# EAGLE design EVGP_Estop_Daugherboard_with_LED (EAGLE 9.5.1)
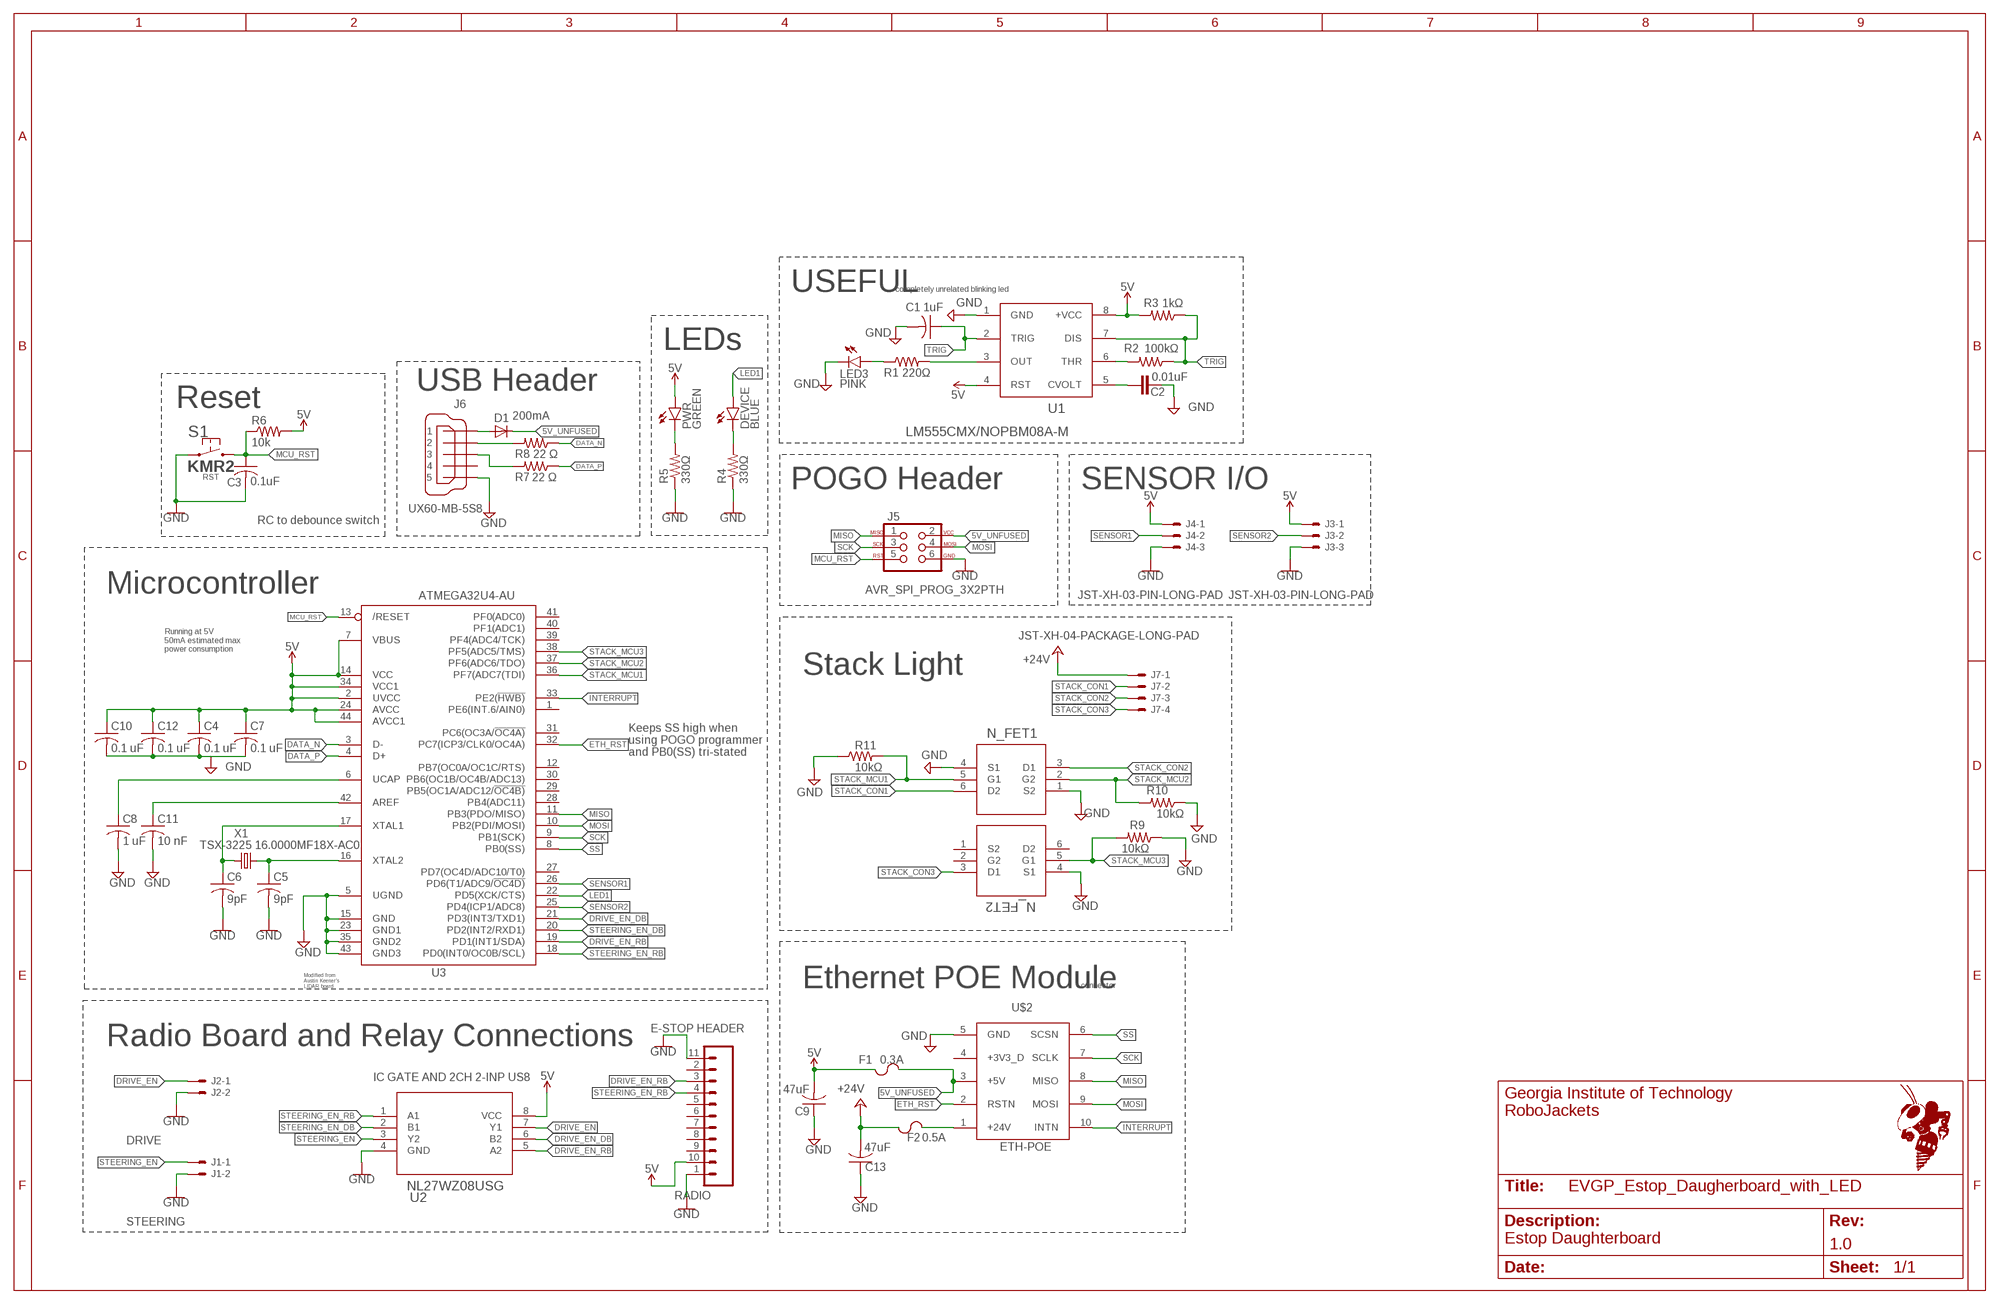
[diagram p0: schematic, sheet 1]
FRAME1 (FRAME_B_L): REVISION: 1.0; SCH_DESC: EVGP Steering Control Board
FRAME2 (FRAME_B_L): REVISION: 1.0; SCH_DESC: EVGP Steering Control Board

## Parts
C1  1uF  C-USC1206  [C1206]
C2  0.01uF  C-EUC0603  [C0603]
C3  0.1uF  C-USC0603  [C0603]
C4  0.1 uF  C-USC0603  [C0603]
C5  9pF  C-USC0603  [C0603]
C6  9pF  C-USC0603  [C0603]
C7  0.1 uF  C-USC0603  [C0603]
C8  1 uF  C-USC0603  [C0603]
C9  47uF  C-USC1206  [C1206]
C10  0.1 uF  C-USC0603  [C0603]
C11  10 nF  C-USC0603  [C0603]
C12  0.1 uF  C-USC0603  [C0603]
C13  47uF  C-USC1206  [C1206]
D1  200mA  DIODE-SOD323-R  [SOD323-R]
DEVICE  BLUE  LEDCHIP-LED0603  [CHIP-LED0603]
F1  0.3A  CHIP_FUSE1206  [F1206]
F2  0.5A  CHIP_FUSE1206  [F1206]
J1  STEERING  JST-XH-02-PIN-LONG-PAD  [JST-XH-02-PACKAGE-LONG-PAD]
J2  DRIVE  JST-XH-02-PIN-LONG-PAD  [JST-XH-02-PACKAGE-LONG-PAD]
J3  JST-XH-03-PIN-LONG-PAD  [JST-XH-03-PACKAGE-LONG-PAD]
J4  JST-XH-03-PIN-LONG-PAD  [JST-XH-03-PACKAGE-LONG-PAD]
J5  AVR_SPI_PROG_3X2PTH  [2X3]
J6  UX60-MB-5S8  [UX60-MB-5S8]
J7  JST-XH-04-PACKAGE-LONG-PAD  JST-XH-04-PIN-LONG-PAD  [JST-XH-04-PACKAGE-LONG-PAD]
LED3  PINK  LEDCHIP-LED0603  [CHIP-LED0603]
PWR  GREEN  LEDCHIP-LED0603  [CHIP-LED0603]
Q1  N_FET2  BSS84DW-7-F  [SOT-363]
Q2  N_FET1  BSS84DW-7-F  [SOT-363]
R1  220Ω  R-US_R0603  [R0603]
R2  100kΩ  R-US_R0603  [R0603]
R3  1kΩ  R-US_R0603  [R0603]
R4  330Ω  R-US_R0603  [R0603]
R5  330Ω  R-US_R0603  [R0603]
R6  10k  R-US_R0603  [R0603]
R7  22 Ω  R-US_R0603  [R0603]
R8  22 Ω  R-US_R0603  [R0603]
R9  10kΩ  R-US_R0603  [R0603]
R10  10kΩ  R-US_R0603  [R0603]
R11  10kΩ  R-US_R0603  [R0603]
RADIO  E-STOP HEADER  ESTOP_RADIO  [RADIO_V1.3]
S1  KMR2  [KMR2]
U1  LM555CMX/NOPBM08A-M  [M08A-M]
U2  NL27WZ08USG  [US8_2P40X2P10]
U3  ATMEGA32U4-AU  [TQFP44]
U$2  ETH-POE  [HDRVR10W64P4000X254_2X5_1016X508X254B]
X1  TSX-3225 16.0000MF18X-AC0  XTAL-3.2X2.5  [XTAL-3.2X2.5]

## Nets
5V [power]: C4.1 C7.1 C9.2 C10.1 C12.1 F1.1 J3.1 J4.1 PWR.A R3.2 R6.2 RADIO.10(5V) U1.4(RST) U1.8(+VCC) U2.8(VCC) U3.2(UVCC) U3.7(VBUS) U3.14(VCC) U3.24(AVCC) U3.34(VCC1) U3.44(AVCC1)
5V_UNFUSED [power]: D1.C F1.2 J5.2 U$2.3(+5V)
24V_UNFUSED: F2.2 U$2.1(+24V)
+24V: C13.2 F2.1 J7.1
AREF: C11.1 U3.42(AREF)
DATA_N [RF]: R8.1 U3.3(D-)
DATA_P [RF]: R7.1 U3.4(D+)
DRIVE_EN: J2.1 U2.7(Y1)
DRIVE_EN_DB: U2.6(B2) U3.21(PD3(INT3/TXD1))
DRIVE_EN_RB: RADIO.3(D1) U2.5(A2) U3.19(PD1(INT1/SDA))
ETH_RST: U3.32(PC7(ICP3/CLK0/OC4A)) U$2.2(RSTN)
GND [power]: C1.2 C2.2 C3.2 C4.2 C5.2 C6.2 C7.2 C8.2 C9.1 C10.2 C11.2 C12.2 C13.1 J1.2 J2.2 J3.3 J4.3 J5.6 J6.5 LED3.C Q1.4(S1) Q2.1(S2) Q2.4(S1) R4.1 R5.1 R9.1 R10.1 R11.1 RADIO.1(GND) RADIO.11(GND) S1.1.1 S1.1.2 U1.1(GND) U2.4(GND) U3.5(UGND) U3.15(GND) U3.23(GND1) U3.35(GND2) U3.43(GND3) U$2.5(GND)
INTERRUPT: U3.33(PE2(!HWB)) U$2.10(INTN)
LED1: DEVICE.A U3.22(PD5(XCK/CTS))
MCU_RST: C3.1 J5.5 R6.1 S1.2.1 S1.2.2 U3.13(/RESET)
MISO: J5.1 U3.11(PB3(PDO/MISO)) U$2.8(MISO)
MOSI: J5.4 U3.10(PB2(PDI/MOSI)) U$2.9(MOSI)
N$1: LED3.A R1.1
N$2: R2.2 U1.6(THR)
N$3: PWR.C R5.2
N$4: C2.1 U1.5(CVOLT)
N$5: J6.2 R8.2
N$6: DEVICE.C R4.2
N$7: D1.A J6.1
N$8: R1.2 U1.3(OUT)
N$11: J6.3 R7.2
SCK: J5.3 U3.9(PB1(SCK)) U$2.7(SCLK)
SENSOR1: J4.2 U3.26(PD6(T1/ADC9/!OC4D))
SENSOR2: J3.2 U3.25(PD4(ICP1/ADC8))
SS: U3.8(PB0(SS)) U$2.6(SCSN)
STACK_CON1: J7.2 Q2.6(D2)
STACK_CON2: J7.3 Q2.3(D1)
STACK_CON3: J7.4 Q1.3(D1)
STACK_MCU1: Q2.5(G1) R11.2 U3.36(PF7(ADC7(TDI))
STACK_MCU2: Q2.2(G2) R10.2 U3.37(PF6(ADC6/TDO))
STACK_MCU3: Q1.5(G1) R9.2 U3.38(PF5(ADC5/TMS))
STEERING_EN: J1.1 U2.3(Y2)
STEERING_EN_DB: U2.2(B1) U3.20(PD2(INT2/RXD1))
STEERING_EN_RB: RADIO.4(D2) U2.1(A1) U3.18(PD0(INT0/OC0B/SCL))
TRIG: C1.1 R2.1 R3.1 U1.2(TRIG) U1.7(DIS)
UCAP: C8.1 U3.6(UCAP)
XTAL1: C6.1 U3.17(XTAL1) X1.1
XTAL2: C5.1 U3.16(XTAL2) X1.3
Unconnected: J6.4 Q1.1(S2) Q1.2(G2) Q1.6(D2) RADIO.2(RST) RADIO.5(D3) RADIO.6(D4) RADIO.7(D5) RADIO.8(D6) RADIO.9(D7) U3.1(PE6(INT.6/AIN0)) U3.12(PB7(OC0A/OC1C/RTS)) U3.27(PD7(OC4D/ADC10/T0)) U3.28(PB4(ADC11)) U3.29(PB5(OC1A/ADC12/!OC4B)) U3.30(PB6(OC1B/OC4B/ADC13)) U3.31(PC6(OC3A/!OC4A)) U3.39(PF4(ADC4/TCK)) U3.40(PF1(ADC1)) U3.41(PF0(ADC0)) U$2.4(+3V3_D)

## Notes on the sheet
- USEFUL | completely unrelated blinking led
- LEDs
- USB Header
- Reset
- POGO Header | SENSOR I/O
- RC to debounce switch
- Microcontroller
- Running at 5V
  50mA estimated max
  power consumption
- Stack Light
- Keeps SS high when
  using POGO programmer
  and PB0(SS) tri-stated
- Modified from 
  Austin Keener's 
  LIDAR board
- Ethernet POE Module | connector
- Radio Board and Relay Connections
- IC GATE AND 2CH 2-INP US8
- Estop Daughterboard

## Library data of the parts
C1 C3 C9 C13 = rcl:C-US: CAPACITOR, American symbol; SPICEPREFIX: C
C2 = rcl:C-EU: CAPACITOR, European symbol; SPICEPREFIX: C
C4-C8 C10-C12 = resistor:C-US: CAPACITOR, American symbol
D1 = RoboJackets-Diodes:DIODE-: DIODE
DEVICE LED3 PWR = led:LED: LED OSRAM: - CHIPLED LG R971, LG N971, LY N971, LG Q971, LY Q971, LO R971, LY R971 LH N974, LH R974 LS Q976, LO Q976, LY Q976 LO Q996 - Hyper CHIPLED LW Q18S LB Q993, LB Q99A, LB R99A - SideLED LS A670, LO A670, LY A670, LG A670, LP A670 LB A673, LV A673, LT A673, LW A673 LH A674 LY A675 LS A676, LA A676, LO A676, LY A676, LW A676 LS A679, LY A679, LG A679 - Hyper Micro SIDELED® LS Y876, LA Y876, LO Y876, LY Y876 LT Y87S - SmartLED LW L88C, LW L88S LB L89C, LB L89S, LG L890 LS L89K, LO L89K, LY L89K LS L896, LA L896, LO L896, LY L896 - TOPLED LS T670, LO T670, LY T670, LG T670, LP T670 LSG T670, LSP T670, LSY T670, LOP T670, LYG T670 LG T671, LOG T671, LSG T671 LB T673, LV T673, LT T673, LW T673 LH T674 LS T676, LA T676, LO T676, LY T676, LB T676, LH T676, LSB T676, LW T676 LB T67C, LV T67C, LT T67C, LS T67K, LO T67K, LY T67K, LW E67C LS E67B, LA E67B, LO E67B, LY E67B, LB E67C, LV E67C, LT E67C LW T67C LS T679, LY T679, LG T679 LS T770, LO T770, LY T770, LG T770, LP T770 LB T773, LV T773, LT T773, LW T773 LH T774 LS E675, LA E675, LY E675, LS T675 LS T776, LA T776, LO T776, LY T776, LB T776 LHGB T686 LT T68C, LB T68C - Hyper Mini TOPLED® LB M676 - Mini TOPLED Santana® LG M470 LS M47K, LO M47K, LY M47K Source: http://www.osram.convergy.de LUXEON: - LUMILED® LXK2-PW12-R00, LXK2-PW12-S00, LXK2-PW14-U00, LXK2-PW14-V00 LXK2-PM12-R00, LXK2-PM12-S00, LXK2-PM14-U00 LXK2-PE12-Q00, LXK2-PE12-R00, LXK2-PE12-S00, LXK2-PE14-T00, LXK2-PE14-U00 LXK2-PB12-K00, LXK2-PB12-L00, LXK2-PB12-M00, LXK2-PB14-N00, LXK2-PB14-P00, LXK2-PB14-Q00 LXK2-PR12-L00, LXK2-PR12-M00, LXK2-PR14-Q00, LXK2-PR14-R00 LXK2-PD12-Q00, LXK2-PD12-R00, LXK2-PD12-S00 LXK2-PH12-R00, LXK2-PH12-S00 LXK2-PL12-P00, LXK2-PL12-Q00, LXK2-PL12-R00 Source: www.luxeon.com KINGBRIGHT: KA-3528ASYC Source: www.kingbright.com
F1 F2 = RoboJackets-Fuses:CHIP_FUSE
J1 J2 = Rembrandt Electronics - JST XH Connectors v1-0:JST-XH-02-PIN: JST XH Connector 2 Pin Wire to board connector. Pitch: 2,54 mm, (0.100") Number of pins: 2 Created by Rembrandt Electronics www.rembrandtelectronics.com
J3 J4 = Rembrandt Electronics - JST XH Connectors v1-0:JST-XH-03-PIN: JST XH Connector 2 Pin Wire to board connector. Pitch: 2,54 mm, (0.100") Number of pins: 3 Created by Rembrandt Electronics www.rembrandtelectronics.com
J5 = SparkFun-Connectors:AVR_SPI_PROG_3X2: AVR ISP 6 Pin This is the reduced ISP connector for AVR programming. Common on Arduino. This footprint will take up less PCB space and can be used with a 10-pin to 6-pin adapter such as SKU: BOB-08508 **Special note about "TEST_POINT" package. The stop mask is on the top side, so if you want your programming test points to be on the bottom of your board, make sure to place this package on the bottom side of the board. This also ensure that the orientation to program from the bottom side will be correct. SparkFun Products: SparkFun ISP Pogo Adapter <https://www.sparkfun.com/products/11591> - NS Tiny AVR Programmer <https://www.sparkfun.com/products/11801> -PTH
J6 = RoboJackets-Connectors:UX60*-MB-5S?: Mini USB Connector Brand: Hirose Electric Co Ltd <http://www.hirose.com/us/> Series: UX <http://www.digikey.com/product-search/en?FV=fff40016,fff802e4,ffec3225> Distributor: Digi-Key <http://www.digikey.com/product-detail/en/UX60A-MB-5ST/H2961CT-ND/597540>; PINS: 5
J7 = Rembrandt Electronics - JST XH Connectors v1-0:JST-XH-04-PIN: JST XH Connector 2 Pin Wire to board connector. Pitch: 2,54 mm, (0.100") Number of pins: 4 Created by Rembrandt Electronics www.rembrandtelectronics.com
Q1 Q2 = Daughterboard-Stuff:BSS84DW-7-F: dual mosfet; MANUFACTURER_PART_NUMBER: BSS84DW7F; VENDOR: Diodes Inc
R1-R11 = rcl:R-US_: RESISTOR, American symbol; SPICEPREFIX: R
RADIO = board_outline:ESTOP_RADIO
S1 = RoboJackets-Switches:KMR2; FUNCTION: RST
U1 = 555:LM555CMX/NOPB; BUILT_BY: EMA_UL_Team; COPYRIGHT: Copyright (C) 2018 Accelerated Designs. All rights reserved; MANUFACTURER_PART_NUMBER: LM555CMX/NOPB; VENDOR: Texas Instruments
U2 = Daughterboard-Stuff:NL27WZ08USG; MANUFACTURER_PART_NUMBER: NL27WZ08USG; VENDOR: ON Semiconductor
U3 = estop-v1.0:ATMEGA32U4: http://www.ladyada.net/library/eagle
U$2 = ethernet_poe:ETH-POE: POE
X1 = RoboJackets-FreqGen:XTAL

## Net classes
0 default: width 0.203 mm, drill 0.508 mm, clearance 0.178 mm
1 power: width 0.305 mm, drill 0.508 mm, clearance 0.178 mm
2 RF: width 0.203 mm, clearance 0.178 mm

## Board
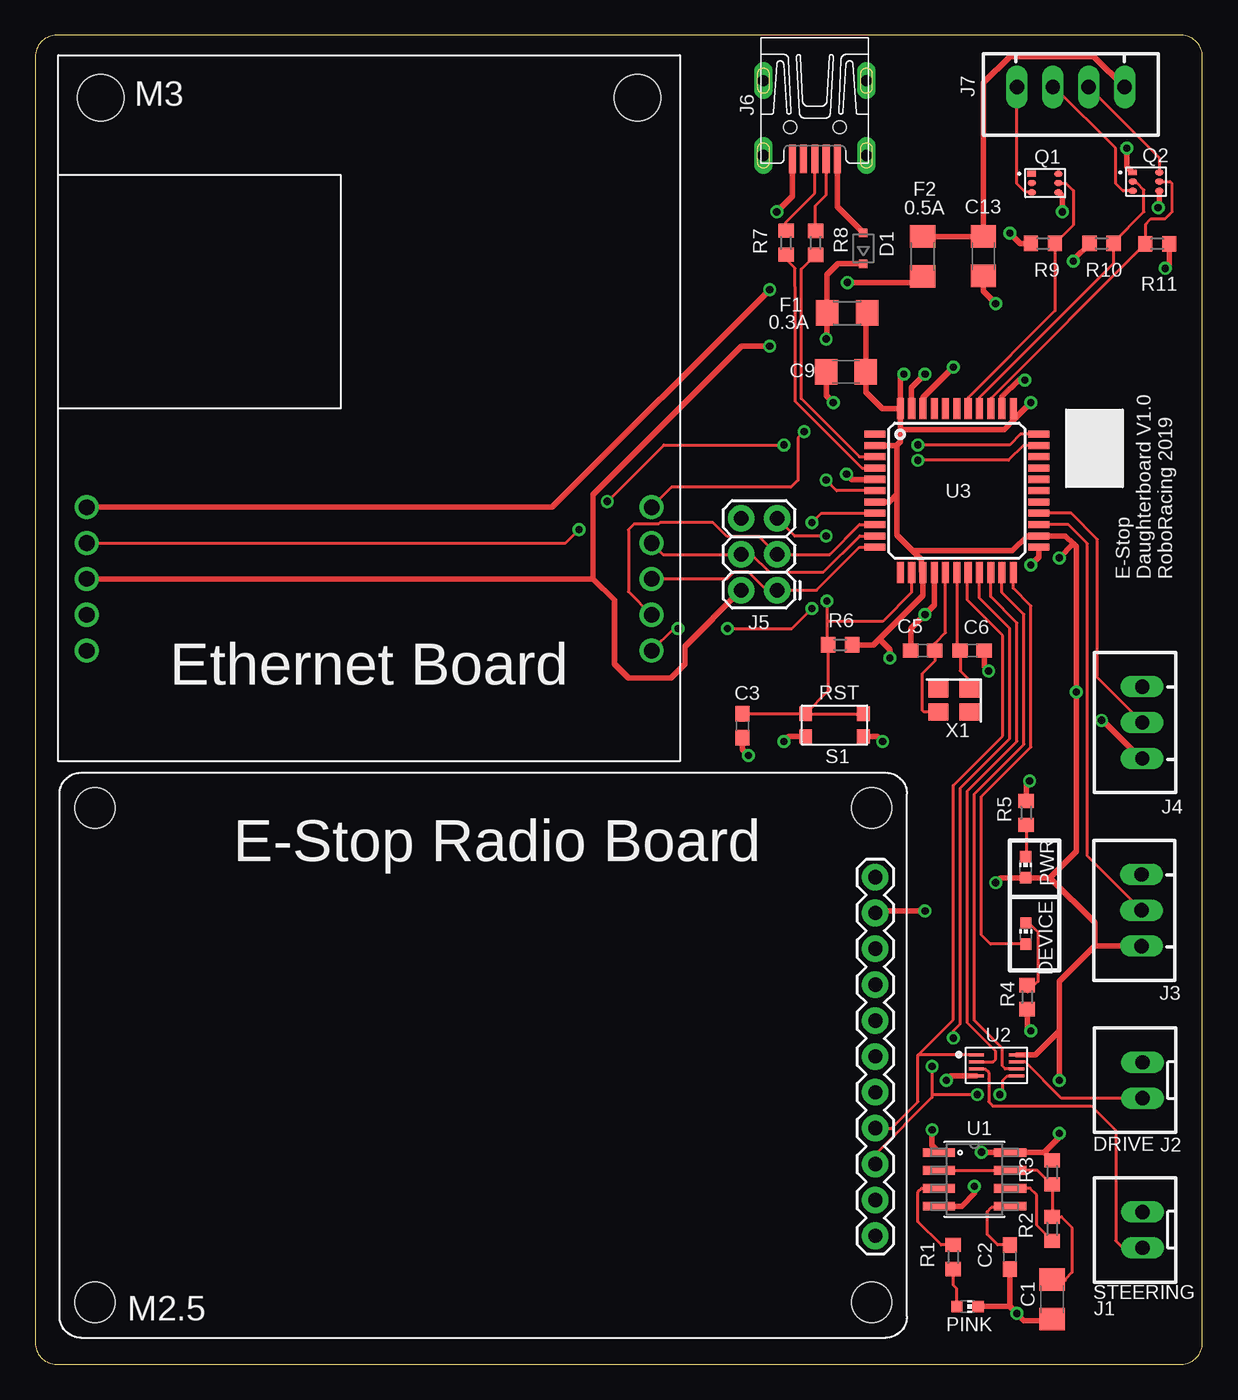
[diagram p1: board, top side]
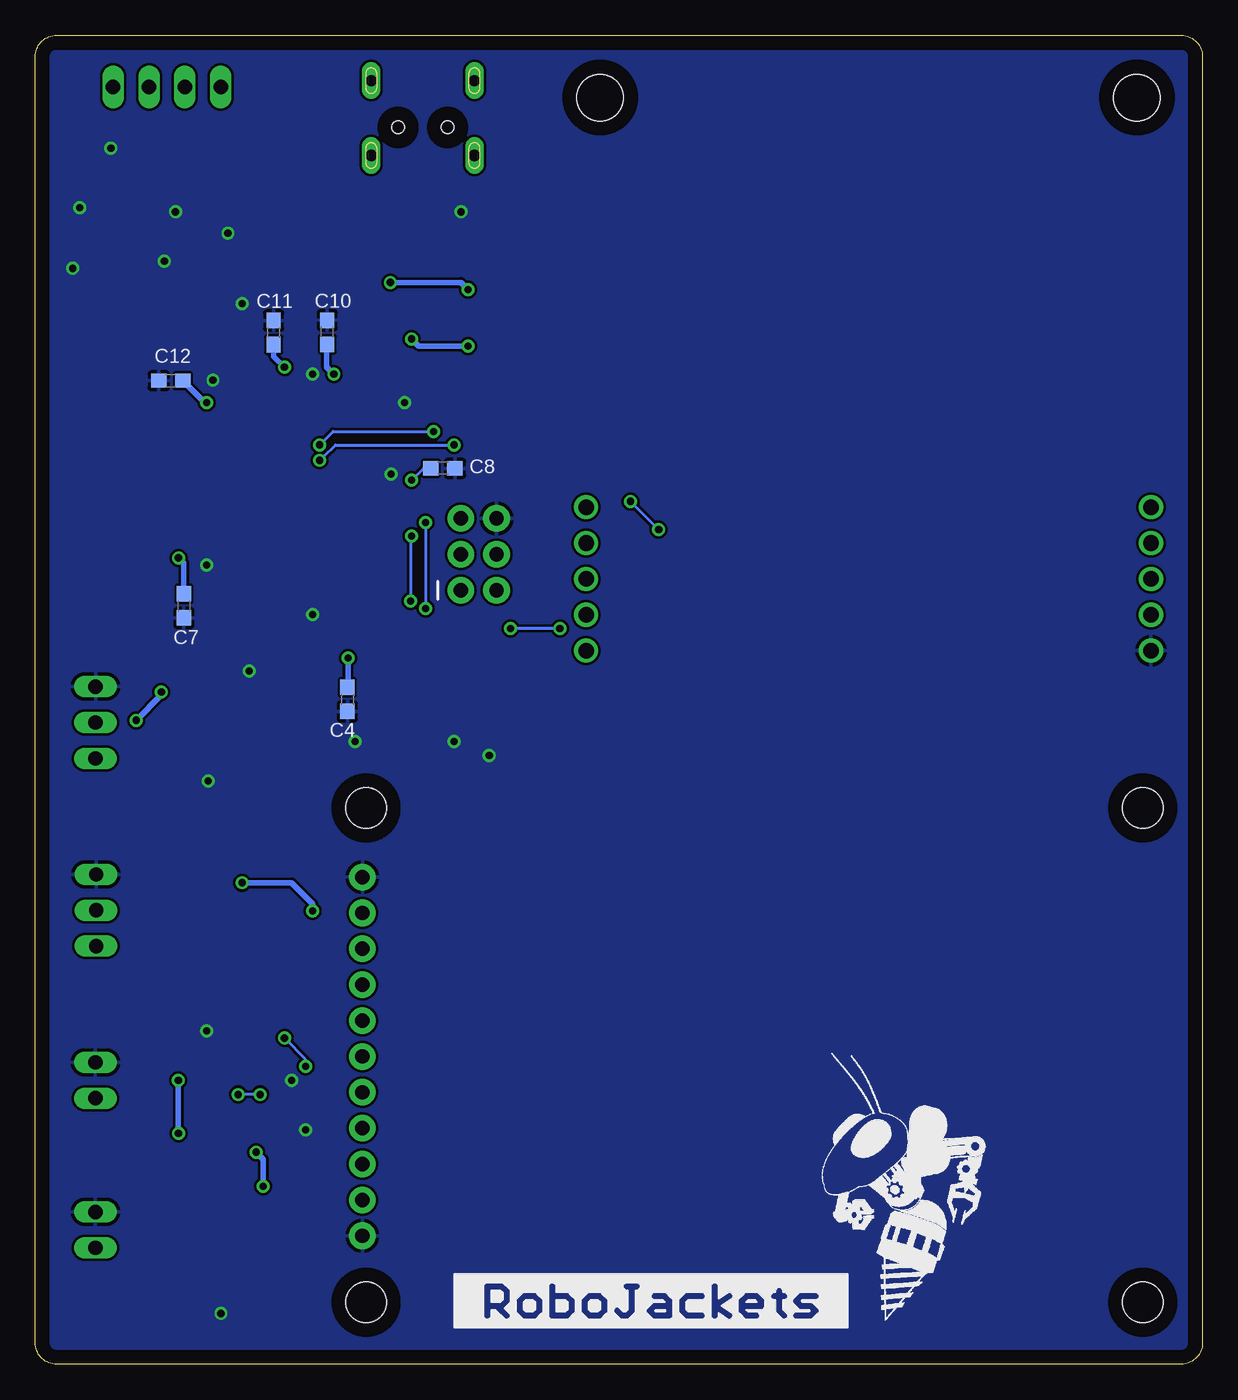
[diagram p2: board, bottom side, seen from below]

Size 82.64 x 94.09 mm. Coordinates in mm from the lower left corner, seen from the top.
Outline: 0,92.59 0,1.5 arc90 1.5,0 81.14,0 arc90 82.64,1.5 82.64,92.59 arc90 81.14,94.09 1.5,94.09 arc90 0,92.59
Copper layers (1*16): Top 0.035mm / dielectric 1.5mm / Bottom 0.035mm
Design rules "default": minimum track width 6mil, minimum drill 0.35mm, track to track 6mil, track to pad 6mil, pad to pad 6mil, via to via 6mil, smd to smd 6mil, copper to edge 40mil, drill to drill 6mil, minimum pad ring 10mil, minimum via ring 8mil, stop-mask expansion 4mil, vias tented up to drill 0mil, thermal gap 10mil

### Footprints (pad centres in the part's own frame; a part is rotated, then mirrored left to right if it is on the bottom)
C1206 = smd 1.6 x 1.8: 1 -1.4,0; 2 1.4,0
C0603 = smd 1.1 x 1: 1 -0.85,0; 2 0.85,0
SOD323-R = smd 0.6 x 0.6: A 1.1,0; C -1.1,0
CHIP-LED0603 = smd 0.8 x 0.8: A 0,-0.75; C 0,0.75
F1206 = smd 1.6 x 1.803: 1 -1.422,0; 2 1.422,0
JST-XH-02-PACKAGE-LONG-PAD = drill 1.016 long: 1 -1.27,0; 2 1.27,0
JST-XH-03-PACKAGE-LONG-PAD = drill 1.016 long: 1 -2.54,0; 2 0,0; 3 2.54,0
2X3 = drill 1.016 pad 1.88: 1 0,0; 2 0,2.54; 3 2.54,0; 4 2.54,2.54; 5 5.08,0; 6 5.08,2.54
UX60-MB-5S8 = smd 2 x 0.5: 1 8.65,1.6; 2 8.65,0.8; 3 8.65,0; 4 8.65,-0.8; 5 8.65,-1.6 | drill 0.8 long: M1 3.1,-3.65; M2 3.1,3.65; M3 8.4,3.65; M4 8.4,-3.65 | hole 0.9: 6.4,-1.75; 6.4,1.75
JST-XH-04-PACKAGE-LONG-PAD = drill 1.016 long: 1 -3.81,0; 2 -1.27,0; 3 1.27,0; 4 3.81,0
SOT-363 = smd 0.6 x 0.42: 1 -0.95,0.65; 2 -0.95,0; 3 -0.95,-0.65; 4 0.95,-0.65; 5 0.95,0; 6 0.95,0.65
R0603 = smd 1 x 1.1: 1 -0.85,0; 2 0.85,0
RADIO_V1.3 = drill 1.016 pad 1.88: 1 57.76,7.21; 2 57.76,9.75; 3 57.76,12.29; 4 57.76,14.83; 5 57.76,17.37; 6 57.76,19.91; 7 57.76,22.45; 8 57.76,24.99; 9 57.76,27.53; 10 57.76,30.07; 11 57.76,32.61 | hole 2.85: 2.5,2.5; 57.5,2.5; 2.5,37.5; 57.5,37.5
KMR2 = smd 0.9 x 1: 1.1 -2.05,0.8; 1.2 2.05,0.8; 2.1 -2.05,-0.8; 2.2 2.05,-0.8
M08A-M = smd 2.286 x 0.61: 1 -2.515,1.905; 2 -2.515,0.635; 3 -2.515,-0.635; 4 -2.515,-1.905; 5 2.515,-1.905; 6 2.515,-0.635; 7 2.515,0.635; 8 2.515,1.905
US8_2P40X2P10 = smd 1.067 x 0.203: 1 -1.422,0.75; 2 -1.422,0.25; 3 -1.422,-0.25; 4 -1.422,-0.75; 5 1.422,-0.75; 6 1.422,-0.25; 7 1.422,0.25; 8 1.422,0.75
TQFP44 = smd 1.5 x 0.5: 1 -5.8,4; 2 -5.8,3.2; 3 -5.8,2.4; 4 -5.8,1.6; 5 -5.8,0.8; 6 -5.8,0; 7 -5.8,-0.8; 8 -5.8,-1.6; 9 -5.8,-2.4; 10 -5.8,-3.2; 11 -5.8,-4; 23 5.8,-4; 24 5.8,-3.2; 25 5.8,-2.4; 26 5.8,-1.6; 27 5.8,-0.8; 28 5.8,0; 29 5.8,0.8; 30 5.8,1.6; 31 5.8,2.4; 32 5.8,3.2; 33 5.8,4 | smd 0.5 x 1.5: 12 -4,-5.8; 13 -3.2,-5.8; 14 -2.4,-5.8; 15 -1.6,-5.8; 16 -0.8,-5.8; 17 0,-5.8; 18 0.8,-5.8; 19 1.6,-5.8; 20 2.4,-5.8; 21 3.2,-5.8; 22 4,-5.8; 34 4,5.8; 35 3.2,5.8; 36 2.4,5.8; 37 1.6,5.8; 38 0.8,5.8; 39 0,5.8; 40 -0.8,5.8; 41 -1.6,5.8; 42 -2.4,5.8; 43 -3.2,5.8; 44 -4,5.8
HDRVR10W64P4000X254_2X5_1016X508X254B = drill 1.105 pad 1.705: 1 2,18; 2 2,15.46; 3 2,12.92; 4 2,10.38; 5 2,7.84; 6 42,7.84; 7 42,10.38; 8 42,12.92; 9 42,15.46; 10 42,18 | hole 3.3: 3,47; 41,47
XTAL-3.2X2.5 = smd 1.4 x 1.2: 1 -1.1,-0.8; 2 1.1,-0.8; 3 1.1,0.8; 4 -1.1,0.8

### Placement (x,y rotation side)
C1  72,4.59 270 top
C2  69,7.59 270 top
C3  50.06,45.19 270 top
C4  60.54,47.07 270 bottom
C5  62.84,50.54 180 top
C6  66.34,50.52 0 top
C7  72.12,53.69 270 bottom
C8  53.77,63.43 0 bottom
C9  57.4,70.26 0 top
C10  61.97,73.06 90 bottom
C11  65.76,73.04 90 bottom
C12  73.04,69.63 180 bottom
C13  67.13,78.45 90 top
D1  58.63,79.01 90 top
DEVICE  70.14,30.49 0 top
F1  57.48,74.42 180 top
F2  62.83,78.43 270 top
J1  78.39,9.51 90 top
J2  78.39,20.1 90 top
J3  78.33,32.14 90 top
J4  78.38,45.43 90 top
J5  52.52,54.8 90 top
J6  55.2,93.98 270 top
J7  73.32,90.42 180 top
LED3  66,4.09 270 top
PWR  70.12,35.19 0 top
Q1  71.5,83.63 0 top
Q2  78.65,83.73 0 top
R1  65,7.59 90 top
R2  72,9.59 270 top
R3  72,13.59 90 top
R4  70.24,25.99 90 top
R5  70.16,39.04 270 top
R6  56.99,50.93 0 top
R7  53.16,79.4 90 top
R8  55.24,79.39 90 top
R9  71.35,79.35 0 top
R10  75.5,79.35 0 top
R11  79.45,79.33 180 top
RADIO  1.72,1.88 0 top
S1  56.59,45.25 180 top
U1  66.5,13.09 0 top
U2  68.06,21.16 0 top
U3  65.25,61.85 0 top
U$1  [ROBOBUZZ_1.0X]  22.5,3.09 0 bottom
U$2  1.64,42.68 0 top
U$3  [ROBOJACKETS]  53,2.59 0 bottom
X1  65.04,46.99 180 top

### Tracks (layer width: path | path; a pad name or v marks a point on that pad's centre or on a via)
5V  (via drill 0.51)
  Top 0.305: 72.5,23.59 72.51,23.58 | 67.02,14.99 v67,15.01
  Top 0.406: U3.44 59.97,67.65 58.8,68.82 C9.2 58.8,74.32 F1.1 | R6.2 59.34,50.93 59.75,51.34 | 59.75,51.34 62.85,54.44 U3.14 62.73,56.17 62.73,56.98 62.11,57.6 | v75.5,45.59 75.58,45.59 78.28,42.89 J4.1 | v72.5,57.09 73.5,58.09 | v60.5,49.99 60.5,50.59 59.75,51.34 | 73.5,58.09 73.71,57.88 v73.71,47.59 73.71,36.3 71.85,34.44 | 73.5,58.09 72.94,58.65 U3.24 70.24,58.65 69.19,57.6 62.11,57.6 | U3.44 61.25,69.84 v61.5,70.09 | U3.44 61.25,66.19 | 61.25,66.19 61.25,65.34 60.96,65.05 | U3.2 60.96,65.05 | 60.96,65.05 61,65.01 61,61.59 | 61,61.59 60.46,61.05 U3.7 | 61.25,66.19 68.6,66.19 69.25,66.84 | 69.25,66.84 U3.34 | 61,61.59 61,58.71 62.11,57.6 | v70.5,68.09 69.25,66.84 | v63,32.09 59.62,32.09 RADIO.10 | U2.8 70.82,21.91 72.5,23.59 72.5,27.09 75.01,29.6 | 71.85,34.44 PWR.A 68.35,34.44 v68,34.09 | 72.51,23.58 v72.51,20.1 | 67.02,14.99 U1.8 71.44,14.99 | v66.5,12.59 66.5,12.09 65.59,11.18 U1.4 | J3.1 75.01,29.6 | 71.85,34.44 75.01,31.28 75.01,29.6 | 71.44,14.99 R3.2 | 71.44,14.99 72.5,16.05 v72.5,16.35
  Bottom 0.305: 72.51,16.36 v72.5,16.35
  Bottom 0.406: v75.5,45.59 73.71,47.38 v73.71,47.59 | v72.5,57.09 72.12,56.71 C7.1 | v70.5,68.09 70.65,68.09 C12.1 | C4.1 60.5,47.96 v60.5,49.99 | v61.5,70.09 62,70.59 62,72.18 C10.1 | v63,32.09 63,32.59 64.5,34.09 v68,34.09 | v72.51,20.1 72.51,16.36 | v67,15.01 66.5,14.51 v66.5,12.59
5V_UNFUSED  (via drill 0.51)
  Top 0.406: v56,72.59 56.06,72.65 F1.2 56.06,77.15 56.82,77.91 D1.C | U$2.3 19.99,55.6 39.49,55.6 | J5.2 46,50.82 46,49.59 45,48.59 42,48.59 41,49.59 41,54.09 39.49,55.6 | v52,72.09 50,72.09 39.49,61.58 39.49,55.6
  Bottom 0.406: v56,72.59 55.5,72.09 v52,72.09
24V_UNFUSED  (via drill 0.51)
  Top 0.406: F2.2 62.41,76.59 v57.5,76.59 | v52,76.09 36.59,60.68 U$2.1
  Bottom 0.406: v57.5,76.59 52.5,76.59 v52,76.09
+24V
  Top 0.406: J7.1 74.96,92.59 69,92.59 67.13,90.72 C13.2 F2.1
AREF  (via drill 0.51)
  Top 0.406: U3.42 62.85,68.44 v65,70.59
  Bottom 0.406: v65,70.59 65.76,71.35 C11.1
DATA_N
  Top 0.203: U3.3 58.34,64.25 54.24,68.35 54.24,77.54 R8.1
DATA_P
  Top 0.203: U3.4 58.54,63.45 53.8,68.19 53.8,76.09 53.8,76.29 53.8,77.59 53.16,78.23 R7.1
DRIVE_EN
  Top 0.203: J2.1 72.66,18.83 70.08,21.41 U2.7
DRIVE_EN_DB
  Top 0.203: U2.6 68.68,20.91 68.48,21.11 68.48,22.35 66.5,24.33 66.5,40.39 70,43.89 70,53.09 68.45,54.64 U3.21
DRIVE_EN_RB  (via drill 0.51)
  Top 0.203: v65,23.09 65,23.59 65.5,24.09 65.5,40.79 69,44.29 69,52.09 66.85,54.24 U3.19 | 63.5,19.09 v66.71,19.09 | v63.5,21.09 63.5,19.09 | v68.29,19.09 68.5,19.3 68.5,20.09 68.82,20.41 U2.5 | 63.5,19.09 63.5,18.89 59.48,14.87 RADIO.3
  Bottom 0.203: v66.71,19.09 v68.29,19.09 | v65,23.09 63.5,21.59 v63.5,21.09
ETH_RST  (via drill 0.51)
  Top 0.203: U3.32 69.96,65.05 68.91,64 v62.5,64 | U$2.2 37.55,58.14 v38.5,59.09 | v40.5,61.09 44.5,65.09 v53,65.09
  Bottom 0.203: v62.5,64 62.19,64.3 62.17,64.3 61.39,65.09 v53,65.09 | v38.5,59.09 v40.5,61.09
GND  (via drill 0.51)
  Top 0.305: 71.9,3.09 C1.2
  Top 0.406: C3.2 50.06,43.53 v50.5,43.09 | S1.1.2 53.36,44.45 v53,44.09 | S1.1.1 59.64,44.45 v60,44.09 | R5.1 70.16,41.05 v70.4,41.29 | R4.1 70.24,23.85 v70.5,23.59 | U3.23 71.05,57.14 v70.5,56.59 | U2.4 64.82,20.41 v64.5,20.09 | C9.1 56,68.59 v56.5,68.09 | C13.1 67.13,75.96 v68,75.09 | R9.1 69.74,79.35 v69,80.09 | Q1.4 72.71,82.72 v72.71,81.59 | R10.1 73.5,78.2 v73.5,78.09 | R11.1 80.3,77.89 v80,77.59 | J6.5 53.6,82.69 v52.5,81.59 | Q2.1 77.29,84.79 v77.29,86.09 | Q2.4 79.6,81.98 v79.5,81.88 | U3.35 68.45,68.5 69.64,69.68 v70.07,69.68 | U3.43 62.05,69.14 v63,70.09 | U3.5 57.83,62.65 v57.44,63.03 | U3.15 63.65,53.74 v63,53.09 61.99,52.08 C5.2 | C6.2 67.19,49.4 v67.5,49.09 | U1.1 63.5,15.48 v63.5,16.59 | LED3.C 69,4.09 | 69,4.09 v69.5,3.59 70,3.09 71.9,3.09 | C2.2 69,4.09
  pour Bottom: 0,93.59 82.5,93.59 82.5,0.09 0.5,0.09 0.5,93.09
INTERRUPT  (via drill 0.51)
  Top 0.203: U3.33 69.76,65.85 69,65.09 v62.5,65.09 | v54.44,66.03 54,65.59 54,62.59 53.5,62.09 45.05,62.09 U$2.10
  Bottom 0.203: v54.44,66.03 61.56,66.03 v62.5,65.09
LED1
  Top 0.203: U3.22 69.25,54.94 70.5,53.69 70.5,43.69 67,40.19 67,30.38 67.64,29.74 DEVICE.A
MCU_RST  (via drill 0.51)
  Top 0.203: v56.06,54.03 56.06,52.59 | 56.06,52.59 56.06,51.01 R6.1 56.14,47.65 S1.2.2 | v56,58.63 53.77,58.63 J5.5 | C3.1 S1.2.2 | U3.13 62.05,54.64 60,52.59 56.06,52.59 | S1.2.2 S1.2.1
  Bottom 0.203: v56,58.63 56.06,58.57 v56.06,54.03
MISO
  Top 0.203: U3.11 58.36,57.85 55.31,54.8 J5.1 51.78,54.8 50.51,56.07 49.45,56.07 48.98,55.6 U$2.8
MOSI
  Top 0.203: U3.10 58.38,58.65 55.8,56.07 51.99,56.07 50.72,57.34 J5.4 44.44,57.34 U$2.9
N$1
  Top 0.203: LED3.A 65.25,5.34 65,5.59 R1.1
N$2
  Top 0.203: R2.2 70.9,9.84 70.9,11.99 70.44,12.46 U1.6
N$3
  Top 0.203: R5.2 70.16,35.98 PWR.C
N$4
  Top 0.203: 68.92,11.09 67.7,11.09 67.4,10.79 67.4,9.19 68.15,8.44 C2.1
  Top 0.305: U1.5 68.92,11.09
N$5
  Top 0.203: J6.2 56,82.79 55.24,82.03 R8.2
N$6
  Top 0.203: R4.2 70.25,26.34 71,27.1 71,30.59 70.35,31.24 DEVICE.C
N$7
  Top 0.406: D1.A 56.8,81.94 J6.1
N$8
  Top 0.203: U1.3 62.77,12.46 62.5,12.19 62.5,10.09 64.15,8.44 R1.2
N$11
  Top 0.203: R7.2 53.16,80.87 55.2,82.91 J6.3
SCK
  Top 0.203: U3.9 58.36,59.45 56.25,57.34 J5.3 51.25,58.61 48.98,58.61 48,59.59 44.22,59.59 44.13,59.5 42.41,59.5 42,59.09 42,54.7 U$2.7
SENSOR1
  Top 0.203: J4.2 75.2,48.61 75.2,58.39 73.34,60.25 U3.26
SENSOR2
  Top 0.203: J3.2 74.5,35.97 74.5,58.09 73.14,59.45 U3.25
SS  (via drill 0.51)
  Top 0.203: U$2.6 45.21,52.09 v45.5,52.09 | v49,52.09 53.58,52.09 v55,53.51 | v55,59.59 55.66,60.25 U3.8
  Bottom 0.203: v55,59.59 v55,53.51 | v45.5,52.09 v49,52.09
STACK_CON1
  Top 0.203: J7.2 79.6,85.41 Q2.6
STACK_CON2
  Top 0.203: Q2.3 77.01,83.08 76.5,83.59 76.5,86.09 72.17,90.42 J7.3
STACK_CON3
  Top 0.203: Q1.3 70.11,82.98 69.51,83.58 J7.4
STACK_MCU1
  Top 0.203: U3.36 67.65,68.38 R11.2 78.6,80.69 79,81.09 80,81.09 80.5,81.59 80.5,83.59 80.36,83.73 Q2.5
STACK_MCU2
  Top 0.203: Q2.2 77.81,83.62 78.01,83.62 78.5,83.13 78.5,81.59 76.35,79.44 R10.2 76.35,77.94 66.85,68.44 U3.37
STACK_MCU3
  Top 0.203: U3.38 66.05,68.44 72.2,74.59 R9.2 73.5,80.65 73.5,83.09 72.96,83.63 Q1.5
STEERING_EN
  Top 0.203: U2.3 67.24,20.91 67.5,20.65 67.5,20.17 67.5,18.59 67.8,18.29 74.76,18.29 76.5,16.55 76.5,8.74 77,8.24 J1.1
STEERING_EN_DB
  Top 0.203: U3.20 67.65,54.34 69.5,52.49 69.5,44.09 66,40.59 66,24.15 68,22.15 68,21.59 67.82,21.41 U2.2
STEERING_EN_RB
  Top 0.203: U3.18 66,56 66,54.09 68.5,51.59 68.5,44.49 65,40.99 65,24.39 62.52,21.91 | U2.1 62.52,21.91 | RADIO.4 60.62,16.71 62.5,18.59 62.5,21.91 62.52,21.91
TRIG
  Top 0.203: U1.2 U1.7 70.97,13.72 71.95,12.74 R3.1 R2.1 72.65,10.44 73.4,9.69 73.4,6.49 72.9,5.99
  Top 0.305: C1.1 72.9,5.99 | R3.1 71.95,12.74
UCAP  (via drill 0.51)
  Top 0.203: U3.6 56.74,61.85 v56,62.59
  Bottom 0.203: C8.1 55.16,63.43 v56,62.59
XTAL1
  Top 0.203: U3.17 65.25,50.76 | C6.1 65.5,49.09 66.14,48.45 X1.1
  Top 0.305: 65.25,50.76 C6.1
XTAL2
  Top 0.203: X1.3 62.9,46.19 62.8,46.29 62.8,48.89 63.69,49.78 C5.1 63.69,51.04 64.45,51.8 U3.16

### Text on the board
tPlace: M3 | 0.5A | 0.3A | E-Stop / Daughterboard V1.0 / RoboRacing 2019 | Ethernet Board | E-Stop Radio Board | M2.5